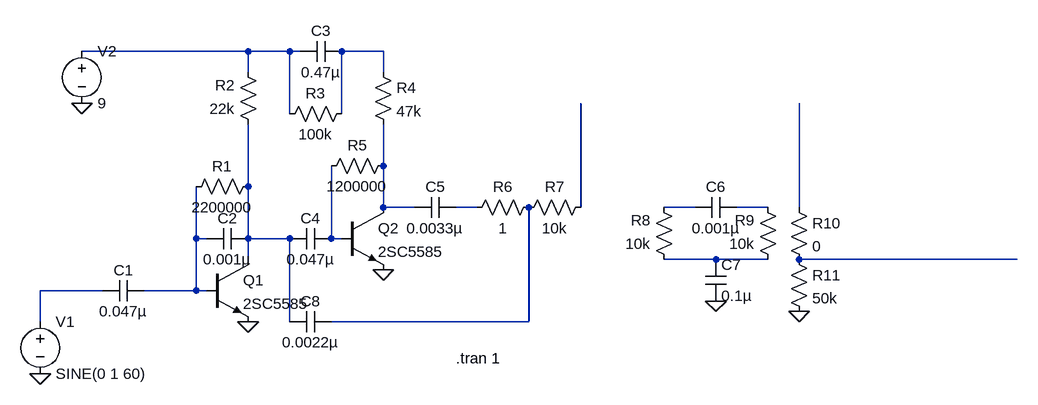
[diagram p0: schematic ShinEi.asc]
ShinEi.asc, the LTspice schematic file:
Version 4
SHEET 1 1684 680
WIRE 496 -256 240 -256
WIRE 560 -256 496 -256
WIRE 576 -256 560 -256
WIRE 704 -256 640 -256
WIRE 496 -224 496 -256
WIRE 704 -224 704 -256
WIRE 560 -160 560 -256
WIRE 640 -160 640 -256
WIRE 704 -80 704 -144
WIRE 496 -48 496 -144
WIRE 704 -16 704 -80
WIRE 752 -16 704 -16
WIRE 848 -16 816 -16
WIRE 1008 -16 1008 -176
WIRE 1184 -16 1136 -16
WIRE 1296 -16 1248 -16
WIRE 1344 -16 1344 -176
WIRE 416 32 416 -48
WIRE 432 32 416 32
WIRE 496 32 496 -48
WIRE 560 32 496 32
WIRE 624 32 624 -80
WIRE 640 32 624 32
WIRE 496 64 496 32
WIRE 1216 64 1136 64
WIRE 1296 64 1216 64
WIRE 1680 64 1344 64
WIRE 272 112 176 112
WIRE 416 112 416 32
WIRE 416 112 336 112
WIRE 432 112 416 112
WIRE 176 160 176 112
WIRE 560 160 560 32
WIRE 928 160 928 -16
WIRE 928 160 624 160
FLAG 1216 128 0
FLAG 704 80 0
FLAG 496 160 0
FLAG 240 -176 0
FLAG 1344 144 0
FLAG 176 240 0
SYMBOL voltage 176 144 R0
WINDOW 123 0 0 Left 0
WINDOW 39 0 0 Left 0
SYMATTR InstName V1
SYMATTR Value SINE(0 1 60)
SYMBOL voltage 240 -272 R0
WINDOW 123 0 0 Left 0
WINDOW 39 0 0 Left 0
SYMATTR InstName V2
SYMATTR Value 9
SYMBOL cap 336 96 R90
WINDOW 0 0 32 VBottom 2
WINDOW 3 32 32 VTop 2
SYMATTR InstName C1
SYMATTR Value 0.047µ
SYMBOL cap 496 16 R90
WINDOW 0 0 32 VBottom 2
WINDOW 3 32 32 VTop 2
SYMATTR InstName C2
SYMATTR Value 0.001µ
SYMBOL res 512 -64 R90
WINDOW 0 0 56 VBottom 2
WINDOW 3 32 56 VTop 2
SYMATTR InstName R1
SYMATTR Value 2200000
SYMBOL res 512 -128 R180
WINDOW 0 36 76 Left 2
WINDOW 3 36 40 Left 2
SYMATTR InstName R2
SYMATTR Value 22k
SYMBOL npn 432 64 R0
SYMATTR InstName Q1
SYMATTR Value 2SC5585
SYMBOL npn 640 -16 R0
SYMATTR InstName Q2
SYMATTR Value 2SC5585
SYMBOL res 656 -176 R90
WINDOW 0 0 56 VBottom 2
WINDOW 3 32 56 VTop 2
SYMATTR InstName R3
SYMATTR Value 100k
SYMBOL cap 640 -272 R90
WINDOW 0 0 32 VBottom 2
WINDOW 3 32 32 VTop 2
SYMATTR InstName C3
SYMATTR Value 0.47µ
SYMBOL res 688 -240 R0
SYMATTR InstName R4
SYMATTR Value 47k
SYMBOL res 720 -96 R90
WINDOW 0 0 56 VBottom 2
WINDOW 3 32 56 VTop 2
SYMATTR InstName R5
SYMATTR Value 1200000
SYMBOL cap 624 16 R90
WINDOW 0 0 32 VBottom 2
WINDOW 3 32 32 VTop 2
SYMATTR InstName C4
SYMATTR Value 0.047µ
SYMBOL cap 816 -32 R90
WINDOW 0 0 32 VBottom 2
WINDOW 3 32 32 VTop 2
SYMATTR InstName C5
SYMATTR Value 0.0033µ
SYMBOL res 944 -32 R90
WINDOW 0 0 56 VBottom 2
WINDOW 3 32 56 VTop 2
SYMATTR InstName R6
SYMATTR Value 1
SYMBOL res 1024 -32 R90
WINDOW 0 0 56 VBottom 2
WINDOW 3 32 56 VTop 2
SYMATTR InstName R7
SYMATTR Value 10k
SYMBOL res 1152 80 R180
WINDOW 0 36 76 Left 2
WINDOW 3 36 40 Left 2
SYMATTR InstName R8
SYMATTR Value 10k
SYMBOL res 1312 80 R180
WINDOW 0 36 76 Left 2
WINDOW 3 36 40 Left 2
SYMATTR InstName R9
SYMATTR Value 10k
SYMBOL cap 1248 -32 R90
WINDOW 0 0 32 VBottom 2
WINDOW 3 32 32 VTop 2
SYMATTR InstName C6
SYMATTR Value 0.001µ
SYMBOL cap 1200 64 R0
SYMATTR InstName C7
SYMATTR Value 0.1µ
SYMBOL cap 624 144 R90
WINDOW 0 0 32 VBottom 2
WINDOW 3 32 32 VTop 2
SYMATTR InstName C8
SYMATTR Value 0.0022µ
SYMBOL res 1328 -32 R0
SYMATTR InstName R10
SYMATTR Value 0
SYMBOL res 1328 48 R0
SYMATTR InstName R11
SYMATTR Value 50k
TEXT 816 216 Left 2 !.tran 1

The netlist it stands for:
* ShinEi.asc
V1 N014 0 SINE(0 1 60)
V2 N001 0 9
C1 N010 N014 0.047µ
C2 N004 N010 0.001µ
R1 N004 N010 2200000
R2 N004 N001 22k
Q1 N004 N010 0 0 2SC5585
Q2 N003 N011 0 0 2SC5585
R3 N002 N001 100k
C3 N002 N001 0.47µ
R4 N002 N003 47k
R5 N003 N011 1200000
C4 N011 N004 0.047µ
C5 N005 N003 0.0033µ
R6 N015 N005 1
R7 N006 N015 10k
R8 N012 N007 10k
R9 N012 N008 10k
C6 N008 N007 0.001µ
C7 N012 0 0.1µ
C8 N015 N004 0.0022µ
R10 N009 N013 0
R11 N013 0 50k
.model NPN NPN
.model PNP PNP
.lib standard.bjt
.tran 1
.backanno
.end